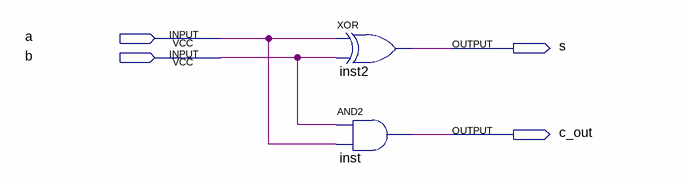
[diagram p0: schematic sheet]
// Quartus schematic HA.bdf as structural Verilog: 2 symbols, 4 pins
module HA (
  input  a,
  input  b,
  output s,
  output c_out
);

  xor inst2 (s, a, b);
  and inst (c_out, b, a);
endmodule
